# Altium schematic sheet CAN 3V3.SchDoc
size A
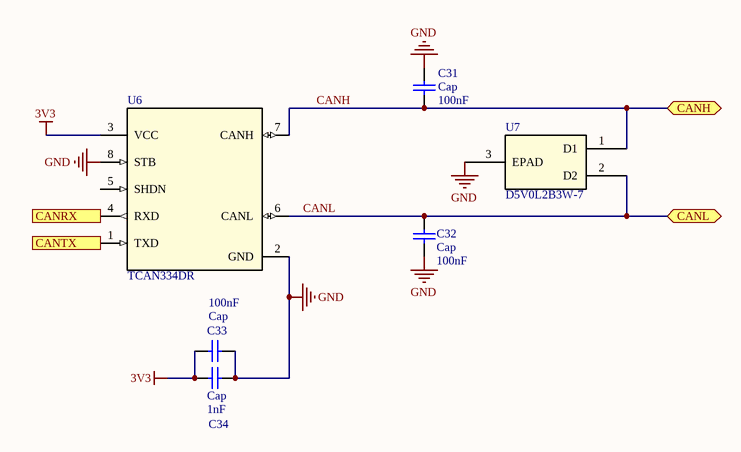
[diagram p0: CAN 3V3.SchDoc]

## Parts
C31  Cap  value 100nF  [1608[0603]]
C32  Cap  value 100nF  [1608[0603]]
C33  Cap  value 100nF  [1608[0603]]
C34  Cap  value 1nF  [1608[0603]]
U6  TCAN334DR  [D0008A_N]
U7  D5V0L2B3W-7  [SOT-323_DIO]

## Ports
CANH (bidir), CANL (bidir), CANRX (out), CANTX (in)

## Nets
3V3: C33.1 C34.2 U6.3(VCC)
GND: C31.1 C32.1 C33.2 C34.1 U6.2(GND) U6.8(STB) U7.3(EPAD)
CANH: C31.2 U6.7(CANH) U7.1(D1) ; port CANH
CANL: C32.2 U6.6(CANL) U7.2(D2) ; port CANL
CANRX: U6.4(RXD) ; port CANRX
CANTX: U6.1(TXD) ; port CANTX

Not connected (* = marked no-connect by the designer): U6 5(SHDN)

## Library data of the parts
C31-C34 = Cap: Capacitor; Published: 8-Jun-2000; LatestRevisionDate: 17-Jul-2002; LatestRevisionNote: Re-released for DXP Platform.; PackageReference: RAD-0.3; Publisher: Altium Limited; PackageDescription: Radial Cap, Thru-Hole; 2 Leads; 0.3 in Pin Spacing
U6 = TCAN334DR: No Description Available; Manufacturer: Texas Instruments; PartNumber: TCAN334DR; RefDes: RefDes; Type: DEV; Value: Value; Copyright: Copyright (C) 2018 Accelerated Designs. All rights reserved
U7 = D5V0L2B3W-7: No Description Available; Vendor: Diodes Inc; Built_By: EMA_UL_Team; SourceLibrary: DIODESINC_2_2015-08-18; Manufacturer_Part_Number: D5V0L2B3W-7; Copyright: Copyright (C) 2018 Accelerated Designs. All rights reserved; RefDes: RefDes; Type: DEV